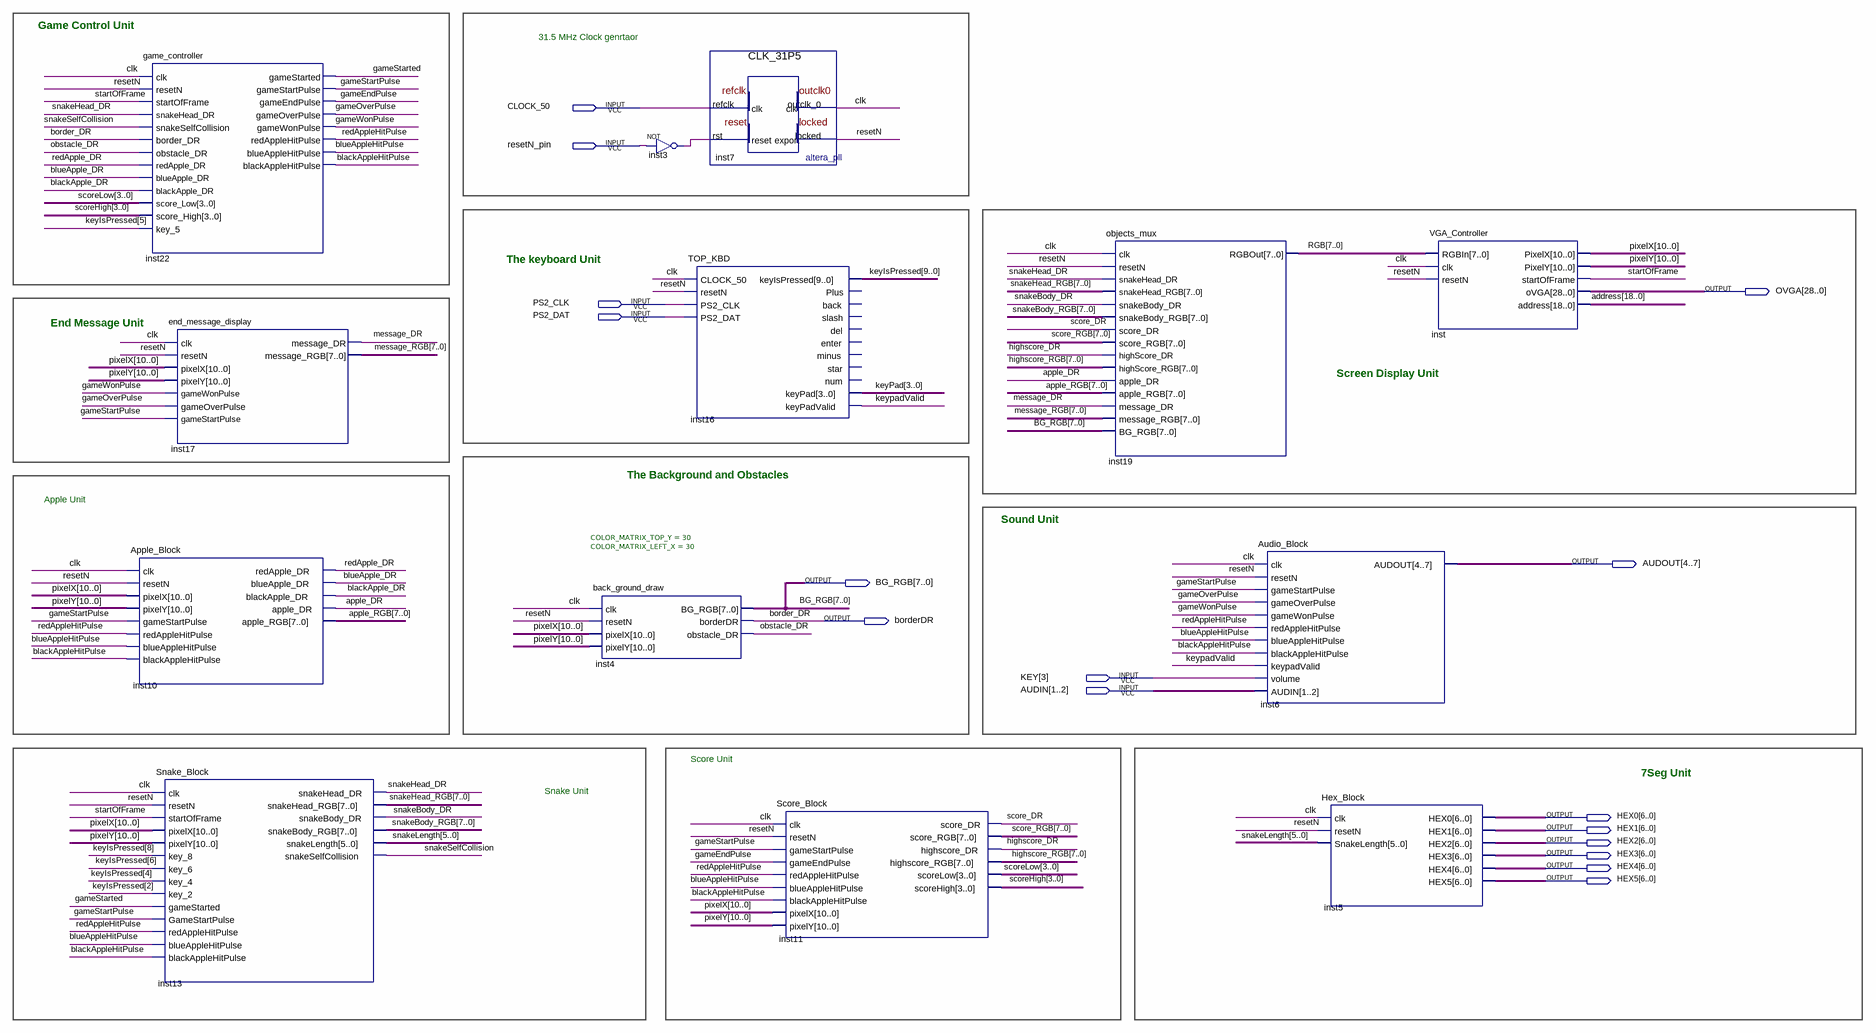
[diagram p0: schematic sheet]
// Quartus schematic TOP_VGA_DEMO.bdf as structural Verilog: 13 symbols, 16 pins
module TOP_VGA_DEMO (
  input  CLOCK_50,
  input  resetN_pin,
  input  PS2_CLK,
  input  PS2_DAT,
  input  [3:3] KEY,
  input  [1:2] AUDIN,
  output [28:0] OVGA,
  output [4:7] AUDOUT,
  output [7:0] BG_RGB,
  output borderDR,
  output [6:0] HEX0,
  output [6:0] HEX1,
  output [6:0] HEX2,
  output [6:0] HEX3,
  output [6:0] HEX4,
  output [6:0] HEX5
);

  wire apple_DR, blackApple_DR, blackAppleHitPulse, blueApple_DR, blueAppleHitPulse, clk, gameEndPulse,
       gameOverPulse, gameStarted, gameStartPulse, gameWonPulse, highscore_DR, inst3_out, keypadValid,
       message_DR, obstacle_DR, redApple_DR, redAppleHitPulse, resetN, score_DR, snakeBody_DR, snakeHead_DR,
       snakeSelfCollision, startOfFrame;
  wire [3:0] keyPad, scoreHigh, scoreLow;
  wire [5:0] snakeLength;
  wire [7:0] apple_RGB, highscore_RGB, message_RGB, RGB, score_RGB, snakeBody_RGB, snakeHead_RGB;
  wire [9:0] keyIsPressed;
  wire [10:0] pixelX, pixelY;
  wire [18:0] address;

  game_controller inst22 (
    .clk(clk), .resetN(resetN), .startOfFrame(startOfFrame), .snakeHead_DR(snakeHead_DR),
    .snakeSelfCollision(snakeSelfCollision), .border_DR(borderDR), .obstacle_DR(obstacle_DR),
    .redApple_DR(redApple_DR), .blueApple_DR(blueApple_DR), .blackApple_DR(blackApple_DR),
    .score_Low(scoreLow), .score_High(scoreHigh), .key_5(keyIsPressed[5]), .gameStarted(gameStarted),
    .gameStartPulse(gameStartPulse), .gameEndPulse(gameEndPulse), .gameOverPulse(gameOverPulse),
    .gameWonPulse(gameWonPulse), .redAppleHitPulse(redAppleHitPulse), .blueAppleHitPulse(blueAppleHitPulse),
    .blackAppleHitPulse(blackAppleHitPulse));
  Apple_Block inst10 (
    .clk(clk), .resetN(resetN), .pixelX(pixelX), .pixelY(pixelY), .gameStartPulse(gameStartPulse),
    .redAppleHitPulse(redAppleHitPulse), .blueAppleHitPulse(blueAppleHitPulse),
    .blackAppleHitPulse(blackAppleHitPulse), .redApple_DR(redApple_DR), .blueApple_DR(blueApple_DR),
    .blackApple_DR(blackApple_DR), .apple_DR(apple_DR), .apple_RGB(apple_RGB));
  Snake_Block inst13 (
    .clk(clk), .resetN(resetN), .startOfFrame(startOfFrame), .pixelX(pixelX), .pixelY(pixelY),
    .key_8(keyIsPressed[8]), .key_6(keyIsPressed[6]), .key_4(keyIsPressed[4]), .key_2(keyIsPressed[2]),
    .gameStarted(gameStarted), .GameStartPulse(gameStartPulse), .redAppleHitPulse(redAppleHitPulse),
    .blueAppleHitPulse(blueAppleHitPulse), .blackAppleHitPulse(blackAppleHitPulse),
    .snakeHead_DR(snakeHead_DR), .snakeHead_RGB(snakeHead_RGB), .snakeBody_DR(snakeBody_DR),
    .snakeBody_RGB(snakeBody_RGB), .snakeLength(snakeLength), .snakeSelfCollision(snakeSelfCollision));
  end_message_display inst17 (
    .clk(clk), .resetN(resetN), .pixelX(pixelX), .pixelY(pixelY), .gameWonPulse(gameWonPulse),
    .gameOverPulse(gameOverPulse), .gameStartPulse(gameStartPulse), .message_DR(message_DR),
    .message_RGB(message_RGB));
  back_ground_draw #(.COLOR_MATRIX_TOP_Y(30), .COLOR_MATRIX_LEFT_X(30)) inst4 (
    .clk(clk), .resetN(resetN), .pixelX(pixelX), .pixelY(pixelY), .BG_RGB(BG_RGB), .borderDR(borderDR),
    .obstacle_DR(obstacle_DR));
  not inst3 (inst3_out, resetN_pin);
  CLK_31P5 inst7 (.refclk(CLOCK_50), .rst(inst3_out), .outclk_0(clk), .locked(resetN));
  TOP_KBD inst16 (
    .CLOCK_50(clk), .resetN(resetN), .PS2_CLK(PS2_CLK), .PS2_DAT(PS2_DAT), .keyIsPressed(keyIsPressed),
    .keyPad(keyPad), .keyPadValid(keypadValid));  // open: Plus, back, slash, del, enter, minus, star, num
  Score_Block inst11 (
    .clk(clk), .resetN(resetN), .gameStartPulse(gameStartPulse), .gameEndPulse(gameEndPulse),
    .redAppleHitPulse(redAppleHitPulse), .blueAppleHitPulse(blueAppleHitPulse),
    .blackAppleHitPulse(blackAppleHitPulse), .pixelX(pixelX), .pixelY(pixelY), .score_DR(score_DR),
    .score_RGB(score_RGB), .highscore_DR(highscore_DR), .highscore_RGB(highscore_RGB), .scoreLow(scoreLow),
    .scoreHigh(scoreHigh));
  objects_mux inst19 (
    .clk(clk), .resetN(resetN), .snakeHead_DR(snakeHead_DR), .snakeHead_RGB(snakeHead_RGB),
    .snakeBody_DR(snakeBody_DR), .snakeBody_RGB(snakeBody_RGB), .score_DR(score_DR), .score_RGB(score_RGB),
    .highScore_DR(highscore_DR), .highScore_RGB(highscore_RGB), .apple_DR(apple_DR), .apple_RGB(apple_RGB),
    .message_DR(message_DR), .message_RGB(message_RGB), .BG_RGB(BG_RGB), .RGBOut(RGB));
  Audio_Block inst6 (
    .clk(clk), .resetN(resetN), .gameStartPulse(gameStartPulse), .gameOverPulse(gameOverPulse),
    .gameWonPulse(gameWonPulse), .redAppleHitPulse(redAppleHitPulse), .blueAppleHitPulse(blueAppleHitPulse),
    .blackAppleHitPulse(blackAppleHitPulse), .keypadValid(keypadValid), .volume(KEY[3]), .AUDIN(AUDIN),
    .AUDOUT(AUDOUT));
  Hex_Block inst5 (
    .clk(clk), .resetN(resetN), .SnakeLength(snakeLength), .HEX0(HEX0), .HEX1(HEX1), .HEX2(HEX2),
    .HEX3(HEX3), .HEX4(HEX4), .HEX5(HEX5));
  VGA_Controller inst (
    .RGBIn(RGB), .clk(clk), .resetN(resetN), .PixelX(pixelX), .PixelY(pixelY), .startOfFrame(startOfFrame),
    .oVGA(OVGA), .address(address));

  // Other names for the same wires on the sheet: border_DR = borderDR

  // Notes on the sheet:
  //   Game Control Unit
  //   31.5 MHz Clock genrtaor
  //   The keyboard Unit
  //   End Message Unit
  //   Screen Display Unit
  //   The Background and Obstacles
  //   Apple Unit
  //   Sound Unit
  //   Score Unit
  //   7Seg Unit
  //   Snake Unit
endmodule
